# Altium schematic sheet leds_vaga.SchDoc
size A4; SheetNumber: 3; SheetTotal: 5; SPICEModelCacheCQHLDZPU: <root> / <DocumentId>CQHLDZPU</DocumentId> / </root>
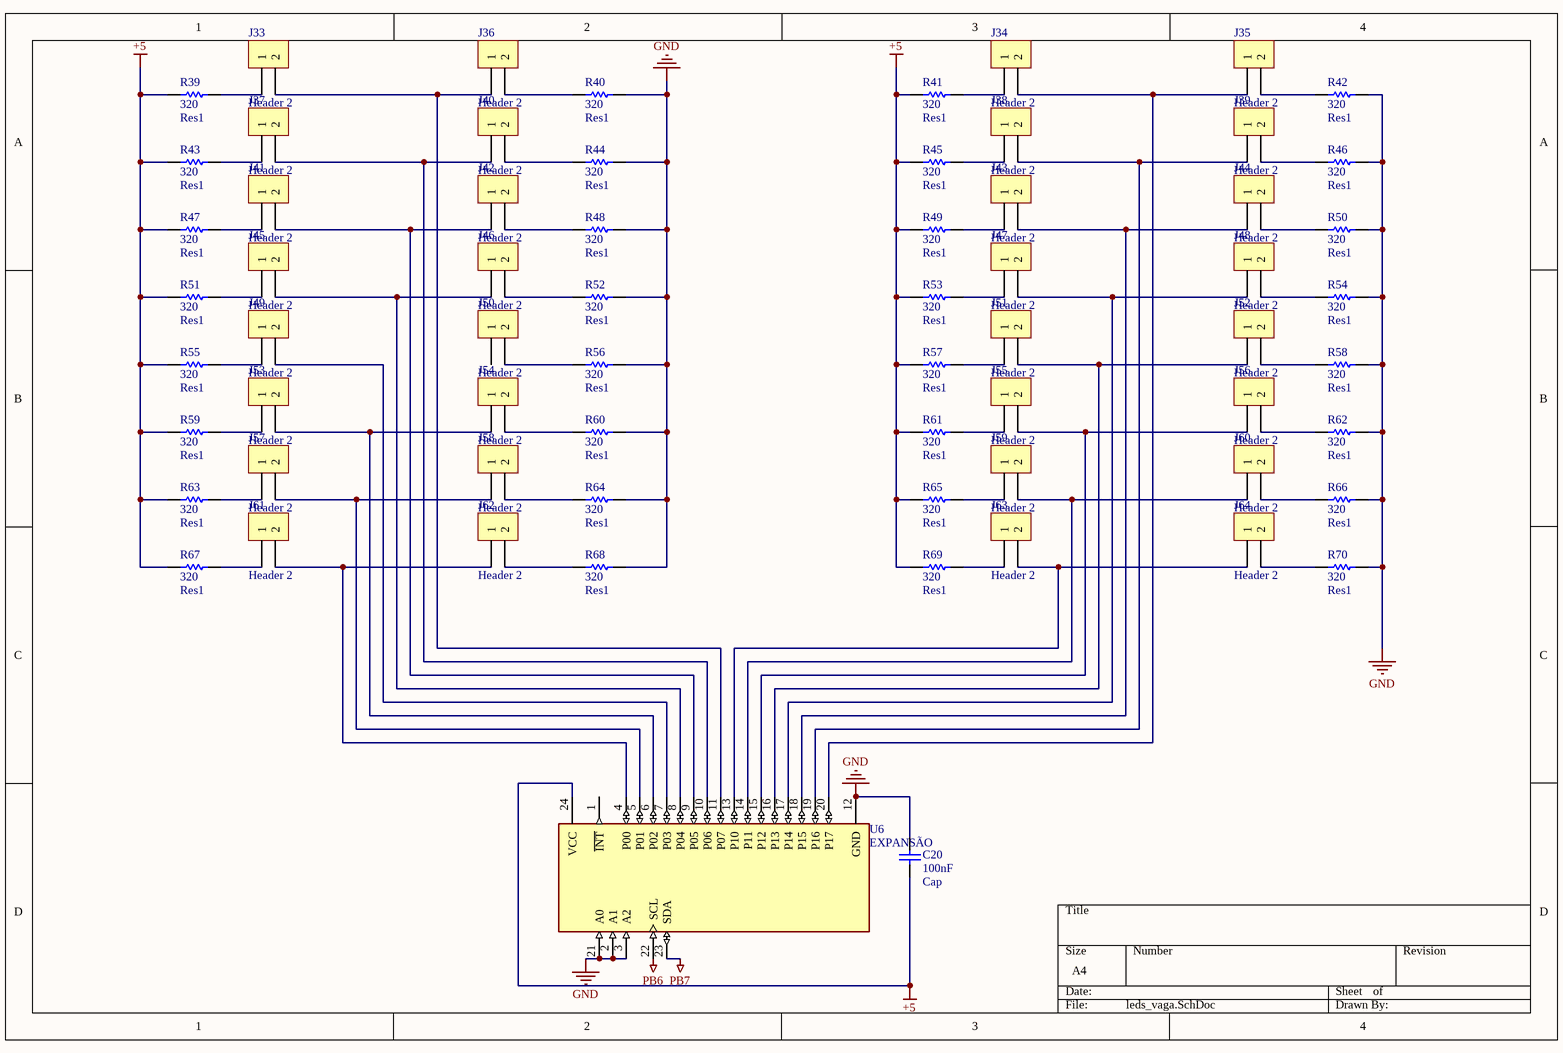
[diagram p0: leds_vaga.SchDoc]

## Parts
C20  Cap  value 100nF  [CAP100N]
J33  Header 2  [Header_KK_2vias]
J34  Header 2  [Header_KK_2vias]
J35  Header 2  [Header_KK_2vias]
J36  Header 2  [Header_KK_2vias]
J37  Header 2  [Header_KK_2vias]
J38  Header 2  [Header_KK_2vias]
J39  Header 2  [Header_KK_2vias]
J40  Header 2  [Header_KK_2vias]
J41  Header 2  [Header_KK_2vias]
J42  Header 2  [Header_KK_2vias]
J43  Header 2  [Header_KK_2vias]
J44  Header 2  [Header_KK_2vias]
J45  Header 2  [Header_KK_2vias]
J46  Header 2  [Header_KK_2vias]
J47  Header 2  [Header_KK_2vias]
J48  Header 2  [Header_KK_2vias]
J49  Header 2  [Header_KK_2vias]
J50  Header 2  [Header_KK_2vias]
J51  Header 2  [Header_KK_2vias]
J52  Header 2  [Header_KK_2vias]
J53  Header 2  [Header_KK_2vias]
J54  Header 2  [Header_KK_2vias]
J55  Header 2  [Header_KK_2vias]
J56  Header 2  [Header_KK_2vias]
J57  Header 2  [Header_KK_2vias]
J58  Header 2  [Header_KK_2vias]
J59  Header 2  [Header_KK_2vias]
J60  Header 2  [Header_KK_2vias]
J61  Header 2  [Header_KK_2vias]
J62  Header 2  [Header_KK_2vias]
J63  Header 2  [Header_KK_2vias]
J64  Header 2  [Header_KK_2vias]
R39  Res1  value 320  [RES320]
R40  Res1  value 320  [RES320]
R41  Res1  value 320  [RES320]
R42  Res1  value 320  [RES320]
R43  Res1  value 320  [RES320]
R44  Res1  value 320  [RES320]
R45  Res1  value 320  [RES320]
R46  Res1  value 320  [RES320]
R47  Res1  value 320  [RES320]
R48  Res1  value 320  [RES320]
R49  Res1  value 320  [RES320]
R50  Res1  value 320  [RES320]
R51  Res1  value 320  [RES320]
R52  Res1  value 320  [RES320]
R53  Res1  value 320  [RES320]
R54  Res1  value 320  [RES320]
R55  Res1  value 320  [RES320]
R56  Res1  value 320  [RES320]
R57  Res1  value 320  [RES320]
R58  Res1  value 320  [RES320]
R59  Res1  value 320  [RES320]
R60  Res1  value 320  [RES320]
R61  Res1  value 320  [RES320]
R62  Res1  value 320  [RES320]
R63  Res1  value 320  [RES320]
R64  Res1  value 320  [RES320]
R65  Res1  value 320  [RES320]
R66  Res1  value 320  [RES320]
R67  Res1  value 320  [RES320]
R68  Res1  value 320  [RES320]
R69  Res1  value 320  [RES320]
R70  Res1  value 320  [RES320]
U6  EXPANSÃO  [Modulo]

## Nets
+5: C20.1 R39.1 R41.1 R43.1 R45.1 R47.1 R49.1 R51.1 R53.1 R55.1 R57.1 R59.1 R61.1 R63.1 R65.1 R67.1 R69.1 U6.24(VCC)
GND: C20.2 R40.2 R42.2 R44.2 R46.2 R48.2 R50.2 R52.2 R54.2 R56.2 R58.2 R60.2 R62.2 R64.2 R66.2 R68.2 R70.2 U6.2(A1) U6.3(A2) U6.12(GND) U6.21(A0)
PB6: U6.22(SCL)
PB7: U6.23(SDA)
NetJ33_1: J33.1 R39.2
NetJ33_2: J33.2 J36.1 U6.11(P07)
NetJ34_1: J34.1 R41.2
NetJ34_2: J34.2 J35.1 U6.20(P17)
NetJ35_2: J35.2 R42.1
NetJ36_2: J36.2 R40.1
NetJ37_1: J37.1 R43.2
NetJ37_2: J37.2 J40.1 U6.10(P06)
NetJ38_1: J38.1 R45.2
NetJ38_2: J38.2 J39.1 U6.19(P16)
NetJ39_2: J39.2 R46.1
NetJ40_2: J40.2 R44.1
NetJ41_1: J41.1 R47.2
NetJ41_2: J41.2 J42.1 U6.9(P05)
NetJ42_2: J42.2 R48.1
NetJ43_1: J43.1 R49.2
NetJ43_2: J43.2 J44.1 U6.18(P15)
NetJ44_2: J44.2 R50.1
NetJ45_1: J45.1 R51.2
NetJ45_2: J45.2 J46.1 U6.8(P04)
NetJ46_2: J46.2 R52.1
NetJ47_1: J47.1 R53.2
NetJ47_2: J47.2 J48.1 U6.17(P14)
NetJ48_2: J48.2 R54.1
NetJ49_1: J49.1 R55.2
NetJ49_2: J49.2 U6.7(P03)
NetJ50_2: J50.2 R56.1
NetJ51_1: J51.1 R57.2
NetJ51_2: J51.2 J52.1 U6.16(P13)
NetJ52_2: J52.2 R58.1
NetJ53_1: J53.1 R59.2
NetJ53_2: J53.2 J54.1 U6.6(P02)
NetJ54_2: J54.2 R60.1
NetJ55_1: J55.1 R61.2
NetJ55_2: J55.2 J56.1 U6.15(P12)
NetJ56_2: J56.2 R62.1
NetJ57_1: J57.1 R63.2
NetJ57_2: J57.2 J58.1 U6.5(P01)
NetJ58_2: J58.2 R64.1
NetJ59_1: J59.1 R65.2
NetJ59_2: J59.2 J60.1 U6.14(P11)
NetJ60_2: J60.2 R66.1
NetJ61_1: J61.1 R67.2
NetJ61_2: J61.2 J62.1 U6.4(P00)
NetJ62_2: J62.2 R68.1
NetJ63_1: J63.1 R69.2
NetJ63_2: J63.2 J64.1 U6.13(P10)
NetJ64_2: J64.2 R70.1

Not connected (* = marked no-connect by the designer): J50 1; U6 1(~{INT})

## Library data of the parts
C20 = Cap: Capacitor; Published: 8-Jun-2000; LatestRevisionDate: 17-Jul-2002; LatestRevisionNote: Re-released for DXP Platform.; PackageReference: RAD-0.3; Publisher: Altium Limited; PackageDescription: Radial Cap, Thru-Hole; 2 Leads; 0.3 in Pin Spacing
J33-J64 = Header 2: Conn KK 2 vias; LatestRevisionDate: 17-Jul-2002; LatestRevisionNote: Re-released for DXP Platform.; Publisher: Altium Limited
R39-R70 = Res1: Resistor; Published: 8-Jun-2000; LatestRevisionDate: 17-Jul-2002; LatestRevisionNote: Re-released for DXP Platform.; PackageReference: AXIAL-0.3; Publisher: Altium Limited; PackageDescription: Axial Device, Thru-Hole; 2 Leads; 0.3 in Pin Spacing
U6 = EXPANSÃO: 16-bit 2.5- to 5.5-V I2C/SMBus I/O expander with interrupt; MF: Texas Instruments; MP: PCF8575DW; SnapEDA_Link: https://www.snapeda.com/parts/PCF8575DW/Texas+Instruments/view-part/?ref=snap; Package: SOIC-24 Texas Instruments; Value: *; Check_prices: https://www.snapeda.com/parts/PCF8575DW/Texas+Instruments/view-part/?ref=eda